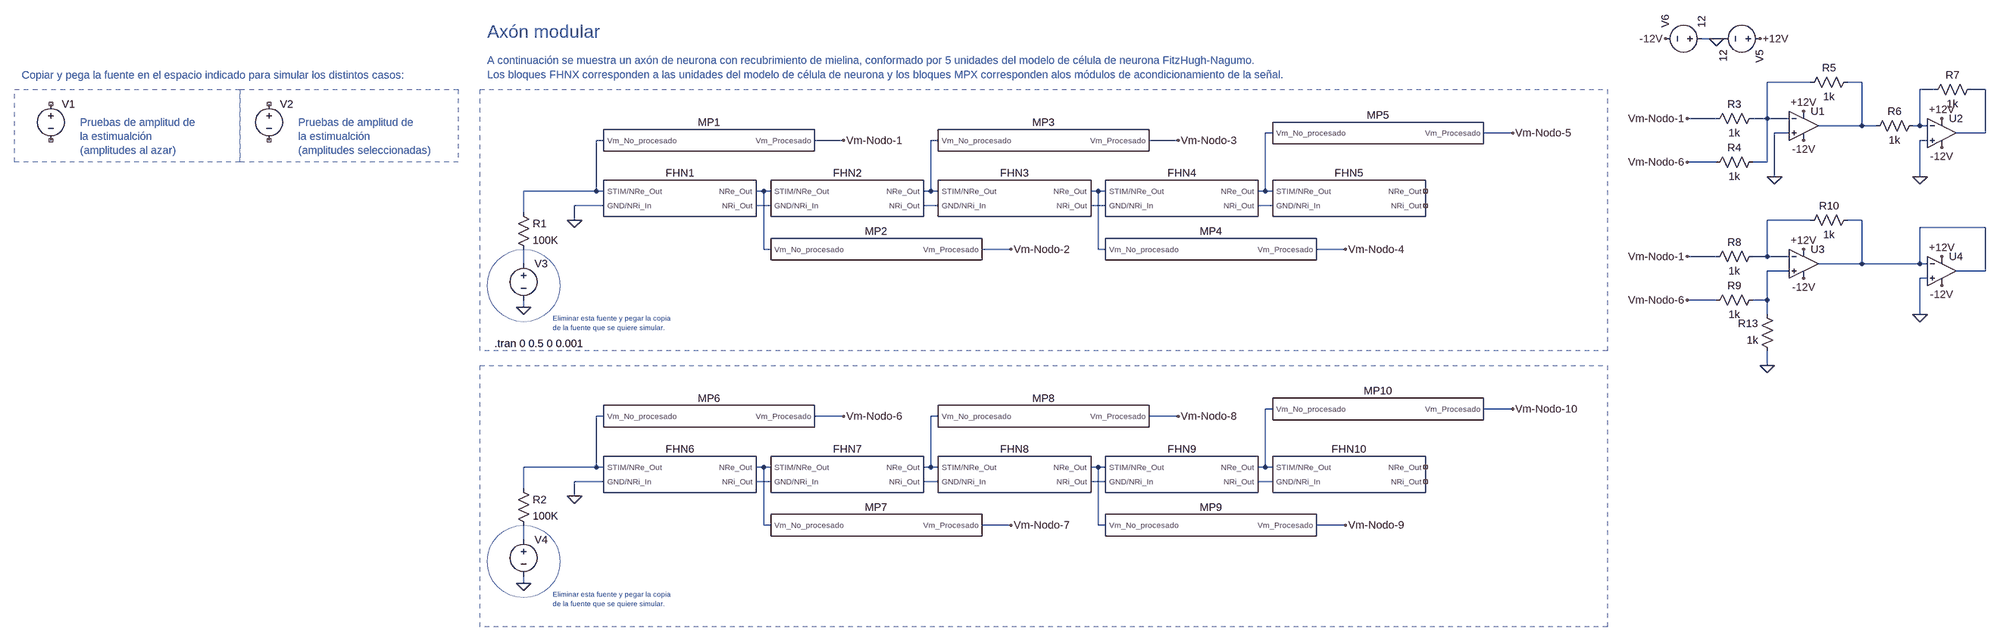
[diagram p0: schematic Axon-Modular - Compound Action Potential.asc]
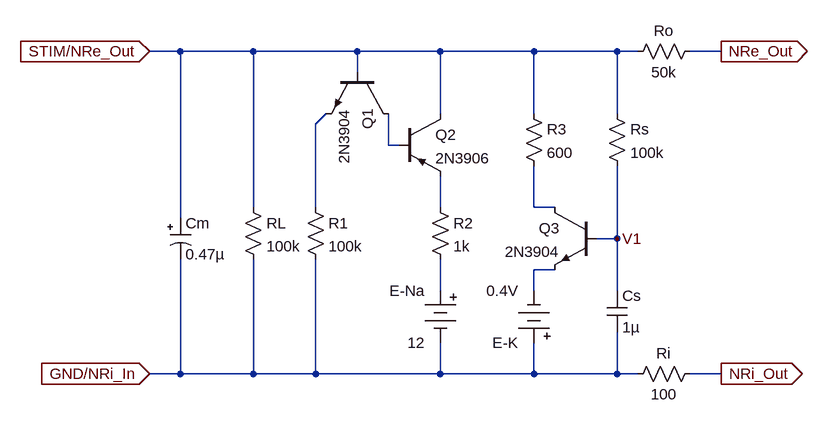
[diagram p1: sub-circuit unidad-de-neurona-fhn.asc]
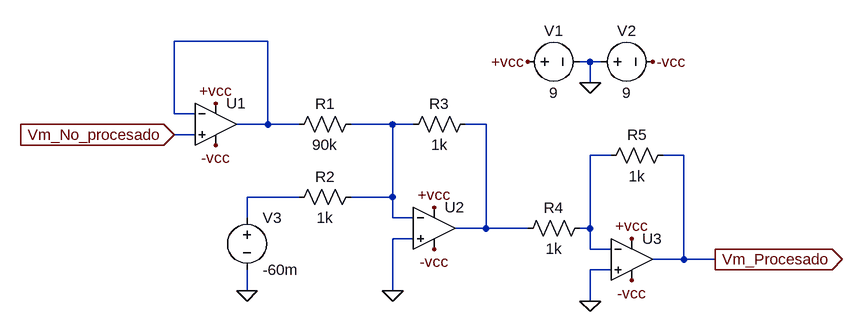
[diagram p2: sub-circuit modulo-procesamiento.asc]
Axon-Modular - Compound Action Potential.asc, the LTspice schematic file:
Version 4
SHEET 1 6732 1092
WIRE 2784 -208 2752 -208
WIRE 2800 -208 2784 -208
WIRE 2992 -112 2896 -112
WIRE 3104 -112 3072 -112
WIRE 3264 -96 3232 -96
WIRE 3376 -96 3344 -96
WIRE 2784 -32 2720 -32
WIRE 2896 -32 2896 -112
WIRE 2896 -32 2864 -32
WIRE 2944 -32 2896 -32
WIRE 3104 -16 3104 -112
WIRE 3104 -16 3008 -16
WIRE 3136 -16 3104 -16
WIRE 3232 -16 3232 -96
WIRE 3232 -16 3216 -16
WIRE 3248 -16 3232 -16
WIRE 1808 0 1792 0
WIRE 2336 0 2272 0
WIRE 2944 0 2912 0
WIRE 3376 0 3376 -96
WIRE 3376 0 3312 0
WIRE 336 16 320 16
WIRE 864 16 800 16
WIRE 1072 16 1056 16
WIRE 1600 16 1536 16
WIRE 3248 16 3232 16
WIRE 2784 64 2720 64
WIRE 2896 64 2896 -32
WIRE 2896 64 2864 64
WIRE 2912 96 2912 0
WIRE 3232 96 3232 16
WIRE 320 128 320 16
WIRE 320 128 160 128
WIRE 336 128 320 128
WIRE 688 128 672 128
WIRE 704 128 688 128
WIRE 1056 128 1056 16
WIRE 1056 128 1040 128
WIRE 1072 128 1056 128
WIRE 1424 128 1408 128
WIRE 1440 128 1424 128
WIRE 1792 128 1792 0
WIRE 1792 128 1776 128
WIRE 1808 128 1792 128
WIRE 336 160 272 160
WIRE 704 160 672 160
WIRE 1072 160 1040 160
WIRE 1440 160 1408 160
WIRE 1808 160 1776 160
WIRE 160 176 160 128
WIRE 272 192 272 160
WIRE 2992 192 2896 192
WIRE 3104 192 3072 192
WIRE 3376 208 3232 208
WIRE 688 256 688 128
WIRE 704 256 688 256
WIRE 1232 256 1168 256
WIRE 1424 256 1424 128
WIRE 1440 256 1424 256
WIRE 1968 256 1904 256
WIRE 2784 272 2720 272
WIRE 2896 272 2896 192
WIRE 2896 272 2864 272
WIRE 2944 272 2896 272
WIRE 160 288 160 256
WIRE 3104 288 3104 192
WIRE 3104 288 3008 288
WIRE 3232 288 3232 208
WIRE 3232 288 3104 288
WIRE 3248 288 3232 288
WIRE 2944 304 2896 304
WIRE 3376 304 3376 208
WIRE 3376 304 3312 304
WIRE 3248 320 3232 320
WIRE 2784 368 2720 368
WIRE 2896 368 2896 304
WIRE 2896 368 2864 368
WIRE 160 384 160 368
WIRE 2896 400 2896 368
WIRE 3232 400 3232 320
WIRE 2896 512 2896 480
WIRE 1808 608 1792 608
WIRE 2336 608 2272 608
WIRE 336 624 320 624
WIRE 864 624 800 624
WIRE 1072 624 1056 624
WIRE 1600 624 1536 624
WIRE 320 736 320 624
WIRE 320 736 160 736
WIRE 336 736 320 736
WIRE 688 736 672 736
WIRE 704 736 688 736
WIRE 1056 736 1056 624
WIRE 1056 736 1040 736
WIRE 1072 736 1056 736
WIRE 1424 736 1408 736
WIRE 1440 736 1424 736
WIRE 1792 736 1792 608
WIRE 1792 736 1776 736
WIRE 1808 736 1792 736
WIRE 336 768 272 768
WIRE 704 768 672 768
WIRE 1072 768 1040 768
WIRE 1440 768 1408 768
WIRE 1808 768 1776 768
WIRE 160 784 160 736
WIRE 272 800 272 768
WIRE 688 864 688 736
WIRE 704 864 688 864
WIRE 1232 864 1168 864
WIRE 1424 864 1424 736
WIRE 1440 864 1424 864
WIRE 1968 864 1904 864
WIRE 160 896 160 864
WIRE 160 992 160 976
FLAG 160 384 0
FLAG 272 192 0
FLAG 864 16 Vm-Nodo-1
FLAG 1232 256 Vm-Nodo-2
FLAG 1600 16 Vm-Nodo-3
FLAG 1968 256 Vm-Nodo-4
FLAG 2336 0 Vm-Nodo-5
FLAG 160 992 0
FLAG 272 800 0
FLAG 864 624 Vm-Nodo-6
FLAG 1232 864 Vm-Nodo-7
FLAG 1600 624 Vm-Nodo-8
FLAG 1968 864 Vm-Nodo-9
FLAG 2336 608 Vm-Nodo-10
FLAG 2912 96 0
FLAG 2720 -32 Vm-Nodo-1
FLAG 2720 64 Vm-Nodo-6
FLAG 2784 -208 0
FLAG 2880 -208 +12V
FLAG 2672 -208 -12V
FLAG 2976 -48 +12V
FLAG 2976 16 -12V
FLAG 3280 -32 +12V
FLAG 3280 32 -12V
FLAG 3232 96 0
FLAG 2720 272 Vm-Nodo-1
FLAG 2720 368 Vm-Nodo-6
FLAG 2976 256 +12V
FLAG 2976 320 -12V
FLAG 3280 272 +12V
FLAG 3280 336 -12V
FLAG 3232 400 0
FLAG 2896 512 0
SYMBOL Unidad-de-Neurona-FHN 496 144 R0
SYMATTR InstName FHN1
SYMBOL Unidad-de-Neurona-FHN 864 144 R0
SYMATTR InstName FHN2
SYMBOL voltage -880 -80 R0
WINDOW 123 0 0 Left 0
WINDOW 39 0 0 Left 0
WINDOW 3 24 44 Invisible 2
SYMATTR Value PWL(0 0 5m 0 5.0000001m 0.5 15m 0.5 15.000001m 0 40m 0 40.000001m 1 70m 1 70.00001m 0 130m 0 130.00001m 2 150m 2 150.00001m 0 190m 0 190.00001m 3 200m 3 200.00001m 0 240m 0 240.00001m 5 250m 5 250.00001m 0 290m 0 290.00001m 5 330m 5 330.00001m 0 350m 0 350.00001m 5 400m 5 400.00001m 0 430m 0 430.00001m 7 450m 7 450.00001m 0 480m 0 480.00001m 7 520m 7 520.00001m 0 550m 0 550.00001m 1 610m 1 610.00001m 0 700m 0 700.00001m 0.5 760m 0.5 760.00001m 0 780m 0 780.00001m 1 870.m 1 870.00001m 0)
SYMATTR InstName V1
SYMBOL res 144 160 R0
SYMATTR InstName R1
SYMATTR Value 100K
SYMBOL Unidad-de-Neurona-FHN 1232 144 R0
SYMATTR InstName FHN3
SYMBOL Unidad-de-Neurona-FHN 1600 144 R0
SYMATTR InstName FHN4
SYMBOL Unidad-de-Neurona-FHN 1968 144 R0
SYMATTR InstName FHN5
SYMBOL Modulo-Procesamiento 560 16 R0
SYMATTR InstName MP1
SYMBOL Modulo-Procesamiento 928 256 R0
SYMATTR InstName MP2
SYMBOL Modulo-Procesamiento 1296 16 R0
SYMATTR InstName MP3
SYMBOL Modulo-Procesamiento 1664 256 R0
SYMATTR InstName MP4
SYMBOL Modulo-Procesamiento 2032 0 R0
SYMATTR InstName MP5
SYMBOL voltage -400 -80 R0
WINDOW 123 0 0 Left 0
WINDOW 39 0 0 Left 0
WINDOW 3 24 44 Invisible 2
SYMATTR Value PWL(0 0 5m 0 5.0000001m 0.5 15m 0.5 15.000001m 0 70m 0 70.000001m 1 80m 1 80.000001m 0 135m 0 135.000001m 2 145m 2 145.000001m 0 200m 0 200.000001m 3 210m 3 210.000001m 0 265m 0 265.000001m 4 275m 4 275.000001m 0 330m 0 330.00001m 5 340m 5 340.000001m 0)
SYMATTR InstName V2
SYMBOL voltage 160 272 R0
WINDOW 123 0 0 Left 0
WINDOW 39 0 0 Left 0
WINDOW 3 24 44 Invisible 2
SYMATTR Value PWL(0 0 5m 0 5.0000001m 0.5 15m 0.5 15.000001m 0 70m 0 70.000001m 1 80m 1 80.000001m 0 135m 0 135.000001m 2 145m 2 145.000001m 0 200m 0 200.000001m 3 210m 3 210.000001m 0 265m 0 265.000001m 0 275m 0 275.000001m 0 330m 0 330.00001m 5 340m 5 340.000001m 0)
SYMATTR InstName V3
SYMBOL Unidad-de-Neurona-FHN 496 752 R0
SYMATTR InstName FHN6
SYMBOL Unidad-de-Neurona-FHN 864 752 R0
SYMATTR InstName FHN7
SYMBOL res 144 768 R0
SYMATTR InstName R2
SYMATTR Value 100K
SYMBOL Unidad-de-Neurona-FHN 1232 752 R0
SYMATTR InstName FHN8
SYMBOL Unidad-de-Neurona-FHN 1600 752 R0
SYMATTR InstName FHN9
SYMBOL Unidad-de-Neurona-FHN 1968 752 R0
SYMATTR InstName FHN10
SYMBOL Modulo-Procesamiento 560 624 R0
SYMATTR InstName MP6
SYMBOL Modulo-Procesamiento 928 864 R0
SYMATTR InstName MP7
SYMBOL Modulo-Procesamiento 1296 624 R0
SYMATTR InstName MP8
SYMBOL Modulo-Procesamiento 1664 864 R0
SYMATTR InstName MP9
SYMBOL Modulo-Procesamiento 2032 608 R0
SYMATTR InstName MP10
SYMBOL voltage 160 880 R0
WINDOW 123 0 0 Left 0
WINDOW 39 0 0 Left 0
WINDOW 3 24 44 Invisible 2
SYMATTR Value PWL(0 0 5m 0 5.0000001m 0.5 15m 0.5 15.000001m 0 70m 0 70.000001m 1 80m 1 80.000001m 0 135m 0 135.000001m 2 145m 2 145.000001m 0 200m 0 200.000001m 3 210m 3 210.000001m 0 265m 0 265.000001m 4 275m 4 275.000001m 0 330m 0 330.00001m 5 340m 5 340.000001m 0)
SYMATTR InstName V4
SYMBOL res 2880 -48 R90
WINDOW 0 0 56 VBottom 2
WINDOW 3 32 56 VTop 2
SYMATTR InstName R3
SYMATTR Value 1k
SYMBOL res 2880 48 R90
WINDOW 0 0 56 VBottom 2
WINDOW 3 32 56 VTop 2
SYMATTR InstName R4
SYMATTR Value 1k
SYMBOL res 3088 -128 R90
WINDOW 0 0 56 VBottom 2
WINDOW 3 32 56 VTop 2
SYMATTR InstName R5
SYMATTR Value 1k
SYMBOL OpAmps\\UniversalOpAmp2 2976 -16 R0
SYMATTR InstName U1
SYMBOL voltage 2896 -208 R90
WINDOW 123 0 0 Left 0
WINDOW 39 0 0 Left 0
SYMATTR InstName V5
SYMATTR Value 12
SYMBOL voltage 2768 -208 M270
WINDOW 0 24 96 Left 2
WINDOW 3 24 16 Left 2
WINDOW 123 0 0 Left 0
WINDOW 39 0 0 Left 0
SYMATTR InstName V6
SYMATTR Value 12
SYMBOL OpAmps\\UniversalOpAmp2 3280 0 R0
SYMATTR InstName U2
SYMBOL res 3232 -32 R90
WINDOW 0 0 56 VBottom 2
WINDOW 3 32 56 VTop 2
SYMATTR InstName R6
SYMATTR Value 1k
SYMBOL res 3360 -112 R90
WINDOW 0 0 56 VBottom 2
WINDOW 3 32 56 VTop 2
SYMATTR InstName R7
SYMATTR Value 1k
SYMBOL res 2880 256 R90
WINDOW 0 0 56 VBottom 2
WINDOW 3 32 56 VTop 2
SYMATTR InstName R8
SYMATTR Value 1k
SYMBOL res 2880 352 R90
WINDOW 0 0 56 VBottom 2
WINDOW 3 32 56 VTop 2
SYMATTR InstName R9
SYMATTR Value 1k
SYMBOL res 3088 176 R90
WINDOW 0 0 56 VBottom 2
WINDOW 3 32 56 VTop 2
SYMATTR InstName R10
SYMATTR Value 1k
SYMBOL OpAmps\\UniversalOpAmp2 2976 288 R0
SYMATTR InstName U3
SYMBOL OpAmps\\UniversalOpAmp2 3280 304 R0
SYMATTR InstName U4
SYMBOL res 2912 496 R180
WINDOW 0 36 76 Left 2
WINDOW 3 36 40 Left 2
SYMATTR InstName R13
SYMATTR Value 1k
TEXT 96 464 Left 2 !.tran 0 0.5 0 0.001
TEXT 80 -224 Left 4 ;Axón modular
TEXT -816 -24 Left 2 ;Pruebas de amplitud de \nla estimualción\n(amplitudes al azar)
TEXT -336 -24 Left 2 ;Pruebas de amplitud de \nla estimualción\n(amplitudes seleccionadas)
TEXT -944 -128 Left 2 ;Copiar y pega la fuente en el espacio indicado para simular los distintos casos:
TEXT 80 -160 Left 2 ;A continuación se muestra un axón de neurona con recubrimiento de mielina, conformado por 5 unidades del modelo de célula de neurona FitzHugh-Nagumo.\nLos bloques FHNX corresponden a las unidades del modelo de célula de neurona y los bloques MPX corresponden alos módulos de acondicionamiento de la señal.
TEXT 224 408 Left 1 ;Eliminar esta fuente y pegar la copia \nde la fuente que se quiere simular.
TEXT 224 1016 Left 1 ;Eliminar esta fuente y pegar la copia \nde la fuente que se quiere simular.
RECTANGLE Normal 2544 480 64 -96 2
RECTANGLE Normal -464 64 -960 -96 2
RECTANGLE Normal 16 64 -464 -96 2
RECTANGLE Normal 2544 1088 64 512 2
CIRCLE Normal 240 416 80 256 2
CIRCLE Normal 240 1024 80 864 2

unidad-de-neurona-fhn.asc, the sub-circuit schematic file:
Version 4
SHEET 1 1332 680
WIRE -368 -96 -416 -96
WIRE -256 -96 -368 -96
WIRE -96 -96 -256 -96
WIRE 32 -96 -96 -96
WIRE 176 -96 32 -96
WIRE 304 -96 176 -96
WIRE 336 -96 304 -96
WIRE 464 -96 416 -96
WIRE -96 -64 -96 -96
WIRE 32 0 32 -96
WIRE 176 0 176 -96
WIRE 304 0 304 -96
WIRE -160 16 -144 0
WIRE -48 48 -48 0
WIRE -32 48 -48 48
WIRE -256 144 -256 -96
WIRE -160 144 -160 16
WIRE 32 144 32 96
WIRE 176 144 176 80
WIRE 208 144 176 144
WIRE -368 160 -368 -96
WIRE 304 192 304 80
WIRE 304 192 272 192
WIRE 208 240 176 240
WIRE 32 272 32 224
WIRE 176 272 176 240
WIRE 304 272 304 192
WIRE -368 400 -368 224
WIRE -368 400 -416 400
WIRE -256 400 -256 224
WIRE -256 400 -368 400
WIRE -160 400 -160 224
WIRE -160 400 -256 400
WIRE 32 400 32 352
WIRE 32 400 -160 400
WIRE 176 400 176 352
WIRE 176 400 32 400
WIRE 304 400 304 336
WIRE 304 400 176 400
WIRE 336 400 304 400
WIRE 464 400 416 400
FLAG -416 -96 STIM/NRe_Out
IOPIN -416 -96 In
FLAG -416 400 GND/NRi_In
IOPIN -416 400 In
FLAG 464 -96 NRe_Out
IOPIN 464 -96 Out
FLAG 464 400 NRi_Out
IOPIN 464 400 Out
FLAG 304 192 V1
SYMBOL res -272 128 R0
SYMATTR InstName RL
SYMATTR Value 100k
SYMBOL res -176 128 R0
SYMATTR InstName R1
SYMATTR Value 100k
SYMBOL res 288 -16 R0
SYMATTR InstName Rs
SYMATTR Value 100k
SYMBOL cap 288 272 R0
SYMATTR InstName Cs
SYMATTR Value 1µ
SYMBOL npn -48 -64 R90
SYMATTR InstName Q1
SYMATTR Value 2N3904
SYMBOL pnp -32 0 R0
SYMATTR InstName Q2
SYMATTR Value 2N3906
SYMBOL Misc\\battery 32 256 M0
WINDOW 123 0 0 Left 0
WINDOW 39 0 0 Left 0
SYMATTR InstName E-Na
SYMATTR Value 12
SYMBOL npn 272 144 M0
SYMATTR InstName Q3
SYMATTR Value 2N3904
SYMBOL res 16 128 R0
SYMATTR InstName R2
SYMATTR Value 1k
SYMBOL polcap -384 160 R0
SYMATTR InstName Cm
SYMATTR Value 0.47µ
SYMBOL res 160 -16 R0
SYMATTR InstName R3
SYMATTR Value 600
SYMBOL res 432 -112 R90
WINDOW 0 0 56 VBottom 2
WINDOW 3 32 56 VTop 2
SYMATTR InstName Ro
SYMATTR Value 50k
SYMBOL res 432 384 R90
WINDOW 0 0 56 VBottom 2
WINDOW 3 32 56 VTop 2
SYMATTR InstName Ri
SYMATTR Value 100
SYMBOL Misc\\battery 176 368 R180
WINDOW 123 0 0 Left 0
WINDOW 39 0 0 Left 0
SYMATTR InstName E-K
SYMATTR Value 0.4V

modulo-procesamiento.asc, the sub-circuit schematic file:
Version 4
SHEET 1 2272 680
WIRE 1264 -112 1120 -112
WIRE 1760 -80 1744 -80
WIRE 1776 -80 1760 -80
WIRE 1760 -48 1760 -80
WIRE 1120 0 1120 -112
WIRE 1152 0 1120 0
WIRE 1264 16 1264 -112
WIRE 1264 16 1216 16
WIRE 1312 16 1264 16
WIRE 1456 16 1392 16
WIRE 1488 16 1456 16
WIRE 1600 16 1568 16
WIRE 1152 32 1120 32
WIRE 1792 64 1760 64
WIRE 1904 64 1872 64
WIRE 1312 128 1232 128
WIRE 1456 128 1456 16
WIRE 1456 128 1392 128
WIRE 1232 160 1232 128
WIRE 1456 160 1456 128
WIRE 1488 160 1456 160
WIRE 1600 176 1600 16
WIRE 1600 176 1552 176
WIRE 1664 176 1600 176
WIRE 1760 176 1760 64
WIRE 1760 176 1744 176
WIRE 1488 192 1456 192
WIRE 1760 208 1760 176
WIRE 1792 208 1760 208
WIRE 1904 224 1904 64
WIRE 1904 224 1856 224
WIRE 1952 224 1904 224
WIRE 1792 240 1760 240
WIRE 1232 272 1232 240
WIRE 1456 272 1456 192
WIRE 1760 288 1760 240
FLAG 1760 -48 0
FLAG 1664 -80 +vcc
FLAG 1856 -80 -vcc
FLAG 1184 -16 +vcc
FLAG 1184 48 -vcc
FLAG 1456 272 0
FLAG 1232 272 0
FLAG 1520 208 -vcc
FLAG 1520 144 +vcc
FLAG 1824 256 -vcc
FLAG 1824 192 +vcc
FLAG 1760 288 0
FLAG 1952 224 Vm_Procesado
IOPIN 1952 224 Out
FLAG 1120 32 Vm_No_procesado
IOPIN 1120 32 In
SYMBOL OpAmps\\UniversalOpAmp 1184 16 R0
SYMATTR InstName U1
SYMBOL OpAmps\\UniversalOpAmp 1520 176 R0
SYMATTR InstName U2
SYMBOL OpAmps\\UniversalOpAmp 1824 224 R0
SYMATTR InstName U3
SYMBOL res 1408 0 R90
WINDOW 0 0 56 VBottom 2
WINDOW 3 32 56 VTop 2
SYMATTR InstName R1
SYMATTR Value 90k
SYMBOL res 1408 112 R90
WINDOW 0 0 56 VBottom 2
WINDOW 3 32 56 VTop 2
SYMATTR InstName R2
SYMATTR Value 1k
SYMBOL res 1760 160 R90
WINDOW 0 0 56 VBottom 2
WINDOW 3 32 56 VTop 2
SYMATTR InstName R4
SYMATTR Value 1k
SYMBOL res 1584 0 R90
WINDOW 0 0 56 VBottom 2
WINDOW 3 32 56 VTop 2
SYMATTR InstName R3
SYMATTR Value 1k
SYMBOL voltage 1648 -80 R270
WINDOW 0 32 56 VTop 2
WINDOW 3 -32 56 VBottom 2
WINDOW 123 0 0 Left 0
WINDOW 39 0 0 Left 0
SYMATTR InstName V1
SYMATTR Value 9
SYMBOL voltage 1760 -80 R270
WINDOW 0 32 56 VTop 2
WINDOW 3 -32 56 VBottom 2
WINDOW 123 0 0 Left 0
WINDOW 39 0 0 Left 0
SYMATTR InstName V2
SYMATTR Value 9
SYMBOL res 1888 48 R90
WINDOW 0 0 56 VBottom 2
WINDOW 3 32 56 VTop 2
SYMATTR InstName R5
SYMATTR Value 1k
SYMBOL voltage 1232 144 R0
WINDOW 123 0 0 Left 0
WINDOW 39 0 0 Left 0
SYMATTR InstName V3
SYMATTR Value -60m

The netlist it stands for:
* Axon-Modular - Compound Action Potential.asc
XFHN1 0 N006 N008 N010 unidad-de-neurona-fhn
XFHN2 N010 N008 N007 N011 unidad-de-neurona-fhn
V1 NC_01 NC_02 PWL(0 0 5m 0 5.0000001m 0.5 15m 0.5 15.000001m 0 40m 0 40.000001m 1 70m 1 70.00001m 0 130m 0 130.00001m 2 150m 2 150.00001m 0 190m 0 190.00001m 3 200m 3 200.00001m 0 240m 0 240.00001m 5 250m 5 250.00001m 0 290m 0 290.00001m 5 330m 5 330.00001m 0 350m 0 350.00001m 5 400m 5 400.00001m 0 430m 0 430.00001m 7 450m 7 450.00001m 0 480m 0 480.00001m 7 520m 7 520.00001m 0 550m 0 550.00001m 1 610m 1 610.00001m 0 700m 0 700.00001m 0.5 760m 0.5 760.00001m 0 780m 0 780.00001m 1 870.m 1 870.00001m 0)
R1 N006 N016 100K
XFHN3 N011 N007 N009 N012 unidad-de-neurona-fhn
XFHN4 N012 N009 N005 N013 unidad-de-neurona-fhn
XFHN5 N013 N005 NC_03 NC_04 unidad-de-neurona-fhn
XMP1 N006 Vm-Nodo-1 modulo-procesamiento
XMP2 N008 Vm-Nodo-2 modulo-procesamiento
XMP3 N007 Vm-Nodo-3 modulo-procesamiento
XMP4 N009 Vm-Nodo-4 modulo-procesamiento
XMP5 N005 Vm-Nodo-5 modulo-procesamiento
V2 NC_05 NC_06 PWL(0 0 5m 0 5.0000001m 0.5 15m 0.5 15.000001m 0 70m 0 70.000001m 1 80m 1 80.000001m 0 135m 0 135.000001m 2 145m 2 145.000001m 0 200m 0 200.000001m 3 210m 3 210.000001m 0 265m 0 265.000001m 4 275m 4 275.000001m 0 330m 0 330.00001m 5 340m 5 340.000001m 0)
V3 N016 0 PWL(0 0 5m 0 5.0000001m 0.5 15m 0.5 15.000001m 0 70m 0 70.000001m 1 80m 1 80.000001m 0 135m 0 135.000001m 2 145m 2 145.000001m 0 200m 0 200.000001m 3 210m 3 210.000001m 0 265m 0 265.000001m 0 275m 0 275.000001m 0 330m 0 330.00001m 5 340m 5 340.000001m 0)
XFHN6 0 N019 N021 N023 unidad-de-neurona-fhn
XFHN7 N023 N021 N020 N024 unidad-de-neurona-fhn
R2 N019 N027 100K
XFHN8 N024 N020 N022 N025 unidad-de-neurona-fhn
XFHN9 N025 N022 N018 N026 unidad-de-neurona-fhn
XFHN10 N026 N018 NC_07 NC_08 unidad-de-neurona-fhn
XMP6 N019 Vm-Nodo-6 modulo-procesamiento
XMP7 N021 Vm-Nodo-7 modulo-procesamiento
XMP8 N020 Vm-Nodo-8 modulo-procesamiento
XMP9 N022 Vm-Nodo-9 modulo-procesamiento
XMP10 N018 Vm-Nodo-10 modulo-procesamiento
V4 N027 0 PWL(0 0 5m 0 5.0000001m 0.5 15m 0.5 15.000001m 0 70m 0 70.000001m 1 80m 1 80.000001m 0 135m 0 135.000001m 2 145m 2 145.000001m 0 200m 0 200.000001m 3 210m 3 210.000001m 0 265m 0 265.000001m 4 275m 4 275.000001m 0 330m 0 330.00001m 5 340m 5 340.000001m 0)
R3 N001 Vm-Nodo-1 1k
R4 N001 Vm-Nodo-6 1k
R5 N002 N001 1k
XU1 0 N001 +12V -12V N002 level2 Avol=1Meg GBW=10Meg Slew=10Meg Ilimit=25m Rail=0 Vos=0 En=0 Enk=0 In=0 Ink=0 Rin=500Meg  ; pins In+ In- V+ V- OUT
V5 +12V 0 12
V6 0 -12V 12
XU2 0 N003 +12V -12V N004 level2 Avol=1Meg GBW=10Meg Slew=10Meg Ilimit=25m Rail=0 Vos=0 En=0 Enk=0 In=0 Ink=0 Rin=500Meg  ; pins In+ In- V+ V- OUT
R6 N003 N002 1k
R7 N004 N003 1k
R8 N014 Vm-Nodo-1 1k
R9 N017 Vm-Nodo-6 1k
R10 N015 N014 1k
XU3 N017 N014 +12V -12V N015 level2 Avol=1Meg GBW=10Meg Slew=10Meg Ilimit=25m Rail=0 Vos=0 En=0 Enk=0 In=0 Ink=0 Rin=500Meg  ; pins In+ In- V+ V- OUT
XU4 0 N015 +12V -12V N015 level2 Avol=1Meg GBW=10Meg Slew=10Meg Ilimit=25m Rail=0 Vos=0 En=0 Enk=0 In=0 Ink=0 Rin=500Meg  ; pins In+ In- V+ V- OUT
R13 0 N017 1k

* block symbol definitions
.subckt unidad-de-neurona-fhn GND/NRi_In STIM/NRe_Out NRe_Out NRi_Out
RL STIM/NRe_Out GND/NRi_In 100k
R1 N001 GND/NRi_In 100k
Rs STIM/NRe_Out V1 100k
Cs V1 GND/NRi_In 1µ
Q1 N002 STIM/NRe_Out N001 0 2N3904
Q2 STIM/NRe_Out N002 N003 0 2N3906
V§E-Na N006 GND/NRi_In 12
Q3 N004 V1 N005 0 2N3904
R2 N003 N006 1k
Cm STIM/NRe_Out GND/NRi_In 0.47µ
R3 STIM/NRe_Out N004 600
Ro NRe_Out STIM/NRe_Out 50k
Ri NRi_Out GND/NRi_In 100
V§E-K GND/NRi_In N005 0.4V
.ends unidad-de-neurona-fhn

.subckt modulo-procesamiento Vm_No_procesado Vm_Procesado
XU1 Vm_No_procesado N001 +vcc -vcc N001 level1 Avol=1Meg GBW=10Meg Vos=0 En=0 Enk=0 In=0 Ink=0 Rin=500Meg  ; pins In+ In- V+ V- OUT
XU2 0 N002 +vcc -vcc N003 level1 Avol=1Meg GBW=10Meg Vos=0 En=0 Enk=0 In=0 Ink=0 Rin=500Meg  ; pins In+ In- V+ V- OUT
XU3 0 N004 +vcc -vcc Vm_Procesado level1 Avol=1Meg GBW=10Meg Vos=0 En=0 Enk=0 In=0 Ink=0 Rin=500Meg  ; pins In+ In- V+ V- OUT
R1 N002 N001 90k
R2 N002 N005 1k
R4 N004 N003 1k
R3 N003 N002 1k
V1 +vcc 0 9
V2 0 -vcc 9
R5 Vm_Procesado N004 1k
V3 N005 0 -60m
.ends modulo-procesamiento

.model NPN NPN
.model PNP PNP
.lib standard.bjt
.tran 0 0.5 0 0.001
* Axón modular
* Pruebas de amplitud de
* la estimualción
* (amplitudes al azar)
* Pruebas de amplitud de
* la estimualción
* (amplitudes seleccionadas)
* Copiar y pega la fuente en el espacio indicado para simular los distintos casos:
* A continuación se muestra un axón de neurona con recubrimiento de mielina, conformado por 5 unidades del modelo de célula de neurona FitzHugh-Nagumo.
* Los bloques FHNX corresponden a las unidades del modelo de célula de neurona y los bloques MPX corresponden alos módulos de acondicionamiento de la señal.
* Eliminar esta fuente y pegar la copia
* de la fuente que se quiere simular.
* Eliminar esta fuente y pegar la copia
* de la fuente que se quiere simular.
.lib UniversalOpAmp1.lib
.lib UniversalOpAmp2.lib
.backanno
.end

* Results of the author's LTspice run, read from the files saved beside the schematic
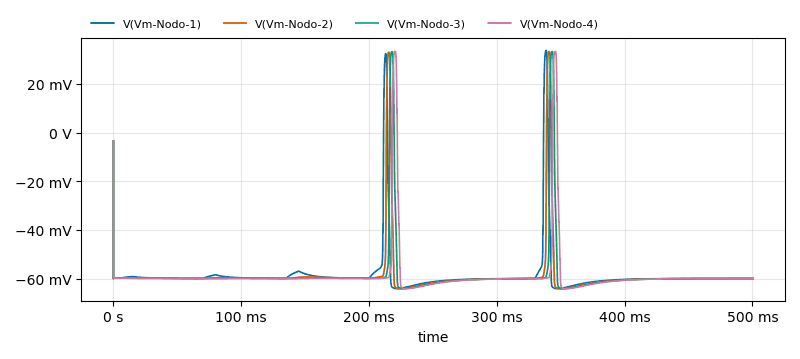
[diagram p3: Transient Analysis of Axon-Modular - Compound Action Potential.asc, plotted from the saved traces]
* Transient Analysis, 1 run:
*   V(Vm-Nodo-1): min -64.16 mV, max 33.78 mV, average -58.73 mV, rms 59.64 mV, last -59.99 mV
*   V(Vm-Nodo-2): min -64.21 mV, max 33.3 mV, average -58.85 mV, rms 59.85 mV, last -60 mV
*   V(Vm-Nodo-3): min -64.21 mV, max 33.29 mV, average -58.88 mV, rms 59.91 mV, last -60.01 mV
*   V(Vm-Nodo-4): min -64.23 mV, max 33.4 mV, average -58.89 mV, rms 59.93 mV, last -60.01 mV